# Altium project VAS83V2.1.PrjPcb
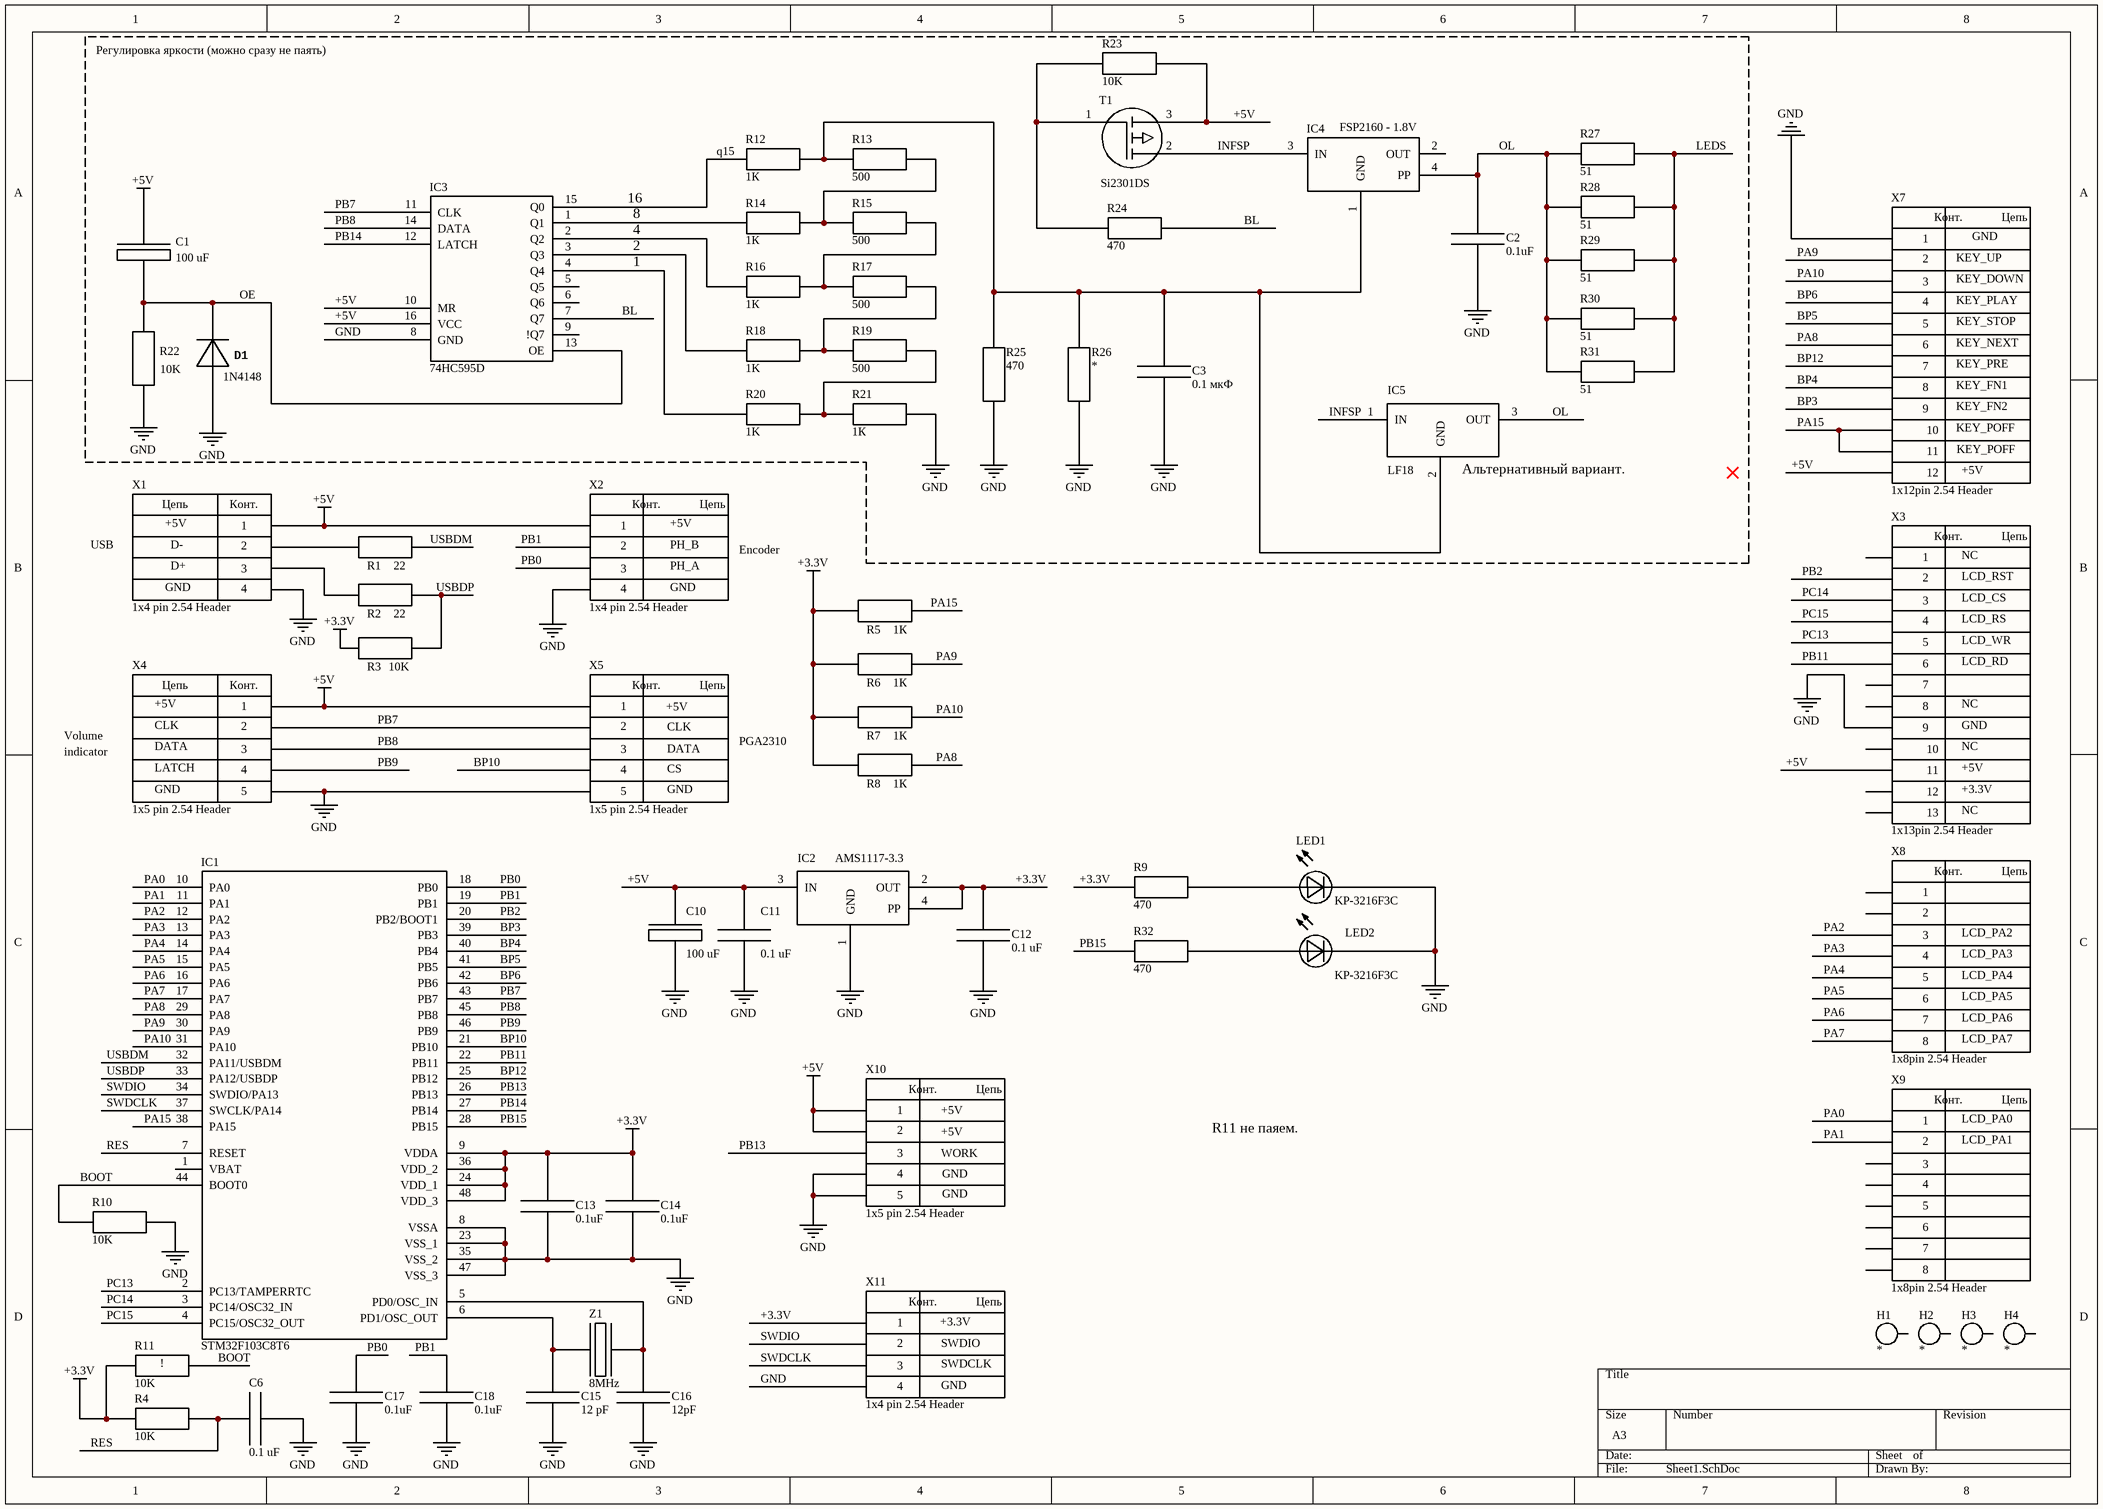
[diagram p0: Sheet1.SchDoc]
1 sheet, 69 parts. Net scope: global (net labels, ports and power ports of the same name join across sheets).
Board file: PCB1.PcbDoc

## Sheet Sheet1.SchDoc
size A3

### Parts
C1  100 uF  [Конденсатор тантал 4x7]
C2  0.1uF  [SMD 1206 Конденсатор]
C3  0.1 мкФ  [SMD 1206 Конденсатор]
C6  0.1 uF  [SMD 1206 Конденсатор]
C10  100 uF  [Конденсатор тантал 4x7]
C11  0.1 uF  [SMD 1206 Конденсатор]
C12  0.1 uF  [SMD 1206 Конденсатор]
C13  0.1uF  [SMD 1206 Конденсатор]
C14  0.1uF  [SMD 1206 Конденсатор]
C15  12 pF  [SMD 1206 Конденсатор]
C16  12pF  [SMD 1206 Конденсатор]
C17  0.1uF  [SMD 1206 Конденсатор]
C18  0.1uF  [SMD 1206 Конденсатор]
D1  1N4148  [SMD 1206 Диод]
H1  *  [Отверстие 3,2]
H2  *  [Отверстие 3,2]
H3  *  [Отверстие 3,2]
H4  *  [Отверстие 3,2]
IC1  STM32F103C8T6  [STM32F103C8T6]
IC2  AMS1117-3.3  [SOT-223]
IC3  74HC595D  [SO-16]
IC4  FSP2160 - 1.8V  [SOT-223]
IC5  LF18  [TO-252]
LED1  KP-3216F3C  [SMD 1206 Светодиод ВАЙТ]
LED2  KP-3216F3C  [SMD 1206 Светодиод ВАЙТ]
R1  22  [SMD 1206 Резистор]
R2  22  [SMD 1206 Резистор]
R3  10K  [SMD 1206 Резистор]
R4  10K  [SMD 1206 Резистор]
R5  1К  [SMD 1206 Резистор]
R6  1К  [SMD 1206 Резистор]
R7  1К  [SMD 1206 Резистор]
R8  1К  [SMD 1206 Резистор]
R9  470  [SMD 1206 Резистор]
R10  10K  [SMD 1206 Резистор]
R11  10K  [SMD 1206 Резистор]
R12  1К  [SMD 1206 Резистор]
R13  500  [SMD 1206 Резистор]
R14  1К  [SMD 1206 Резистор]
R15  500  [SMD 1206 Резистор]
R16  1К  [SMD 1206 Резистор]
R17  500  [SMD 1206 Резистор]
R18  1K  [SMD 1206 Резистор]
R19  500  [SMD 1206 Резистор]
R20  1K  [SMD 1206 Резистор]
R21  1К  [SMD 1206 Резистор]
R22  10K  [SMD 1206 Резистор]
R23  10K  [SMD 1206 Резистор]
R24  470  [SMD 1206 Резистор]
R25  470  [SMD 1206 Резистор]
R26  *  [SMD 1206 Резистор]
R27  51  [SMD 1206 Резистор]
R28  51  [SMD 1206 Резистор]
R29  51  [SMD 1206 Резистор]
R30  51  [SMD 1206 Резистор]
R31  51  [SMD 1206 Резистор]
R32  470  [SMD 1206 Резистор]
T1  Si2301DS  [SMD SOT-23 Транзистор 3 pin]
X1  1x4 pin 2.54 Header  [(1x4)PIN 2.54 HEADR]
X2  1x4 pin 2.54 Header  [(1x4)PIN 2.54 HEADR]
X3  1x13pin 2.54 Header  [(1x13)pin 2.54 header]
X4  1x5 pin 2.54 Header  [(1x5)pin 2.54 Header]
X5  1x5 pin 2.54 Header  [(1x5)pin 2.54 Header]
X7  1x12pin 2.54 Header  [(1x12)pin 2.54 header]
X8  1x8pin 2.54 Header  [(1x8)PIN 2.54 HEADER]
X9  1x8pin 2.54 Header  [(1x8)PIN 2.54 HEADER]
X10  1x5 pin 2.54 Header  [(1x5)pin 2.54 Header]
X11  1x4 pin 2.54 Header  [(1x4)PIN 2.54 HEADR]
Z1  8MHz  [Кварцевый резонатор]

### Nets
+3.3V: C12.1(+) C13.1(+) C14.1(+) IC1.9(VDDA) IC1.24(VDD_1) IC1.36(VDD_2) IC1.48(VDD_3) IC2.2(OUT) IC2.4(PP) R3.1(left) R4.1(left) R5.1(left) R6.1(left) R7.1(left) R8.1(left) R9.1(left) R11.1(left) X11.1
+5V: C1.1 C10.1 C11.1(+) IC2.3(IN) IC3.10(MR) IC3.16(VCC) R23.2(right) T1.3 X1.1 X2.1 X3.11 X4.1 X5.1 X7.12 X10.1 X10.2
GND: C2.2(-) C3.2(-) C6.2(-) C10.2 C11.2(-) C12.2(-) C13.2(-) C14.2(-) C15.2(-) C16.2(-) C17.2(-) C18.2(-) D1.1(А) IC1.8(VSSA) IC1.23(VSS_1) IC1.35(VSS_2) IC1.47(VSS_3) IC2.1(GND) IC3.8(GND) LED1.2(K) LED2.2(K) R10.2(right) R21.2(right) R22.2(right) R25.1(left) R26.2(right) X1.4 X2.4 X3.9 X4.5 X5.5 X7.1 X10.4 X10.5 X11.4
BL: IC3.7(Q7) R24.2(right)
BOOT: IC1.44(BOOT0) R10.1(left) R11.2(right)
BP3: IC1.39(PB3) X7.9
BP4: IC1.40(PB4) X7.8
BP5: IC1.41(PB5) X7.5
BP6: IC1.42(PB6) X7.4
BP10: IC1.21(PB10) X5.4
BP12: IC1.25(PB12) X7.7
INFSP: IC4.3(IN) IC5.1(IN) T1.2
LEDS: R27.2(right) R28.2(right) R29.2(right) R30.2(right) R31.2(right)
OE: C1.2 D1.2(K) IC3.13(OE) R22.1(left)
OL: C2.1(+) IC4.4(PP) IC5.3(OUT) R27.1(left) R28.1(left) R29.1(left) R30.1(left) R31.1(left)
PA0: IC1.10(PA0) X9.1
PA1: IC1.11(PA1) X9.2
PA2: IC1.12(PA2) X8.3
PA3: IC1.13(PA3) X8.4
PA4: IC1.14(PA4) X8.5
PA5: IC1.15(PA5) X8.6
PA6: IC1.16(PA6) X8.7
PA7: IC1.17(PA7) X8.8
PA8: IC1.29(PA8) R8.2(right) X7.6
PA9: IC1.30(PA9) R6.2(right) X7.2
PA10: IC1.31(PA10) R7.2(right) X7.3
PA15: IC1.38(PA15) R5.2(right) X7.10 X7.11
PB0: C17.1(+) IC1.18(PB0) X2.3
PB1: C18.1(+) IC1.19(PB1) X2.2
PB2: IC1.20(PB2/BOOT1) X3.2
PB7: IC1.43(PB7) IC3.11(CLK) X4.2 X5.2
PB8: IC1.45(PB8) IC3.14(DATA) X4.3 X5.3
PB9: IC1.46(PB9) X4.4
PB11: IC1.22(PB11) X3.6
PB13: IC1.26(PB13) X10.3
PB14: IC1.27(PB14) IC3.12(LATCH)
PB15: IC1.28(PB15) R32.2(right)
PC13: IC1.2(PC13/TAMPERRTC) X3.5
PC14: IC1.3(PC14/OSC32_IN) X3.3
PC15: IC1.4(PC15/OSC32_OUT) X3.4
q15: IC3.15(Q0) R12.1(left)
RES: C6.1(+) IC1.7(RESET) R4.2(right)
SWDCLK: IC1.37(SWCLK/PA14) X11.3
SWDIO: IC1.34(SWDIO/PA13) X11.2
USBDM: IC1.32(PA11/USBDM) R1.2(right)
USBDP: IC1.33(PA12/USBDP) R2.2(right) R3.2(right)
NetC3_1: C3.1(+) IC4.1(GND) IC5.2(GND) R12.2(right) R13.1(left) R25.2(right) R26.1(left)
NetC15_1: C15.1(+) IC1.6(PD1/OSC_OUT) Z1.1
NetC16_1: C16.1(+) IC1.5(PD0/OSC_IN) Z1.2
NetIC3_1: IC3.1(Q1) R14.1(left)
NetIC3_2: IC3.2(Q2) R16.1(left)
NetIC3_3: IC3.3(Q3) R18.1(left)
NetIC3_4: IC3.4(Q4) R20.1(left)
NetLED1_1: LED1.1(А) R9.2(right)
NetLED2_1: LED2.1(А) R32.1(left)
NetR1_1: R1.1(left) X1.2
NetR2_1: R2.1(left) X1.3
NetR13_2: R13.2(right) R14.2(right) R15.2(right)
NetR15_1: R15.1(left) R16.2(right) R17.1(left)
NetR17_2: R17.2(right) R18.2(right) R19.1(left)
NetR19_2: R19.2(right) R20.2(right) R21.1(left)
NetR23_1: R23.1(left) R24.1(left) T1.1

Not connected (* = marked no-connect by the designer): H1 1; H2 1; H3 1; H4 1; IC1 1(VBAT); IC3 5(Q5) 6(Q6) 9(!Q7); IC4 2(OUT); X3 1 7 8 10; X8 1 2; X9 3 4 5 6 7 8

### Notes on the sheet
- Регулировка яркости (можно сразу не паять)
- 16
- 2
- 4
- 8
- GND
- 1
- KEY_UP
- KEY_DOWN
- KEY_PLAY
- KEY_STOP
- KEY_NEXT
- KEY_PRE
- KEY_FN1
- KEY_FN2
- KEY_POFF
- (near IC5) Альтернативный вариант.
- +5V
- USB
- D-
- D+
- PH_B
- PH_A
- Encoder
- NC
- LCD_RST
- LCD_CS
- LCD_RS
- LCD_WR
- LCD_RD
- Volume
- indicator
- LATCH
- DATA
- CLK
- CS
- PGA2310
- +3.3V
- LCD_PA2
- LCD_PA3
- LCD_PA4
- LCD_PA5
- LCD_PA6
- LCD_PA7
- LCD_PA0
- WORK
- R11 не паяем.
- LCD_PA1
- (near R11) !
- SWDIO
- SWDCLK
- (in symbol 1x5pin 2.54 Header) Цепь; Конт.
- (in symbol 1x8pin 2.54 Header) Конт.; Цепь
- (in symbol 1x12pin 2.54 Header) Конт.; Цепь
- (in symbol 1x13pin 2.54 Header) Конт.; Цепь; 12; 13
- (in symbol (1x4)pin 2.54 Header) Цепь; Конт.

### Library data of the parts
C1 C10 = Конденсатор: Танталовый; Value: 100 uF
  C1: Case: *
C2 C3 C6 C13-C18 = Конденсатор
  C2 C13 C14 C17 C18: Value: 0.1uF
  C3: Value: 0.1 мкФ; Case: 1206
  C6: Value: 0.1 uF
  C15: Value: 12 pF
  C16: Value: 12pF
C11 C12 = Конденсатор: Керамический; Value: 0.1 uF
D1 = Диод: Value: 1N4148; Case: SMD 1206
H1-H4 = Отверстие монтажное: Value: *
IC1 = STM32F103C8T6: Микроконтроллер; Value: STM32F103C8T6
IC2 = AMS1117: Стабилизатор; Value: AMS1117-3.3
IC4 = FSP2160B J1003H1: Value: FSP2160 - 1.8V
LED1 LED2 = Светодиод: Value: KP-3216F3C; Case: SMD 1206
R1-R32 = Резистор: HelpURL: *; Model: *; Manufacture: *
  R1 R2: Case: SMD 1206; Value: 22
  R3 R22 R23: Case: SMD 1206; Value: 10K
  R4 R10 R11: Case: *; Value: 10K
  R5-R8 R12 R14 R16 R21: Case: SMD 1206; Value: 1К
  R9 R25 R32: Case: SMD 1206; Value: 470
  R13 R15 R17 R19: Case: SMD 1206; Value: 500
  R18: Case: SMD  1206; Value: 1K
  R20: Case: SMD 1206; Value: 1K
  R24: Case: *; Value: 470
  R26: Case: 1206; Value: *
  R27-R31: Case: SMD 1206; Value: 51
T1 = Транзистор MOSFET P-конал (как p-n-p): Value: Si2301DS; Case: *
X1 X2 X11 = (1x4)pin 2.54 Header: Value: 1x4 pin 2.54 Header
  X11: Case: Папа
X3 = 1x13pin 2.54 Header: к LCD; Case: Мама
X4 X5 = 1x5pin 2.54 Header: Value: 1x5 pin 2.54 Header
  X5: Case: Папа
X7 = 1x12pin 2.54 Header: Кнопки; Case: Папа
X8 X9 = 1x8pin 2.54 Header: к LCD; Case: Мама
X10 = 1x5pin 2.54 Header: Папа; Value: 1x5 pin 2.54 Header; Case: Папа
Z1 = Кварцевый резонатор: Value: 8MHz
IC3 = 74HC595D: Value: 74HC595D; Case: SO-16
IC5 = LF18: Value: LF18